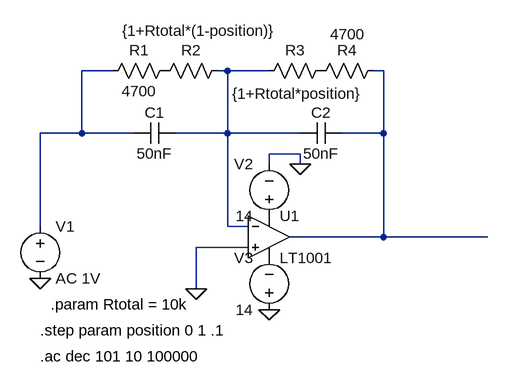
[diagram p0: schematic Lab13Schematic.asc]
Lab13Schematic.asc, the LTspice schematic file:
Version 4
SHEET 1 880 680
WIRE -208 -16 -256 -16
WIRE -32 -16 -48 -16
WIRE 32 -16 -32 -16
WIRE 208 -16 192 -16
WIRE -256 80 -256 -16
WIRE -256 80 -320 80
WIRE -176 80 -256 80
WIRE -32 80 -32 -16
WIRE -32 80 -112 80
WIRE 80 80 -32 80
WIRE 208 80 208 -16
WIRE 208 80 144 80
WIRE 80 112 32 112
WIRE 32 128 32 112
WIRE 80 128 80 112
WIRE -320 224 -320 80
WIRE -32 224 -32 80
WIRE 0 224 -32 224
WIRE 208 240 208 80
WIRE 208 240 64 240
WIRE 368 240 208 240
WIRE 0 256 -80 256
WIRE -80 320 -80 256
FLAG -320 304 0
FLAG -80 320 0
FLAG 32 352 0
FLAG 80 128 0
SYMBOL Opamps\\LT1001 32 176 R0
SYMATTR InstName U1
SYMBOL voltage -320 208 R0
SYMATTR InstName V1
SYMATTR Value AC 1V
SYMBOL voltage 32 224 R180
WINDOW 0 24 96 Left 2
WINDOW 3 24 16 Left 2
SYMATTR InstName V2
SYMATTR Value 14
SYMBOL voltage 32 368 R180
WINDOW 0 24 96 Left 2
WINDOW 3 24 16 Left 2
SYMATTR InstName V3
SYMATTR Value 14
SYMBOL res -112 -32 R90
WINDOW 0 0 56 VBottom 2
WINDOW 3 32 56 VTop 2
SYMATTR InstName R1
SYMATTR Value 4700
SYMBOL res -32 -32 R90
WINDOW 0 0 56 VBottom 2
WINDOW 3 -61 43 VTop 2
SYMATTR InstName R2
SYMATTR Value {1+Rtotal*(1-position)}
SYMBOL res 128 -32 R90
WINDOW 0 0 56 VBottom 2
WINDOW 3 36 53 VTop 2
SYMATTR InstName R3
SYMATTR Value {1+Rtotal*position}
SYMBOL res 208 -32 R90
WINDOW 0 0 56 VBottom 2
WINDOW 3 -56 55 VTop 2
SYMATTR InstName R4
SYMATTR Value 4700
SYMBOL cap 144 64 R90
WINDOW 0 0 32 VBottom 2
WINDOW 3 32 32 VTop 2
SYMATTR InstName C2
SYMATTR Value 50nF
SYMBOL cap -112 64 R90
WINDOW 0 0 32 VBottom 2
WINDOW 3 32 32 VTop 2
SYMATTR InstName C1
SYMATTR Value 50nF
TEXT -304 344 Left 2 !.param Rtotal = 10k
TEXT -320 384 Left 2 !.step param position 0 1 .1
TEXT -320 424 Left 2 !.ac dec 101 10 100000

The netlist it stands for:
* Lab13Schematic.asc
XU1 0 N002 P001 P002 N003 LT1001  ; pins In+ In- V+ V- OUT
V1 N001 0 AC 1V
V2 P001 0 14
V3 0 P002 14
R1 P003 N001 4700
R2 N002 P003 {1+Rtotal*(1-position)}
R3 P004 N002 {1+Rtotal*position}
R4 N003 P004 4700
C2 N003 N002 50nF
C1 N002 N001 50nF
.param Rtotal = 10k
.step param position 0 1 .1
.ac dec 101 10 100000
.lib LTC.lib
.backanno
.end